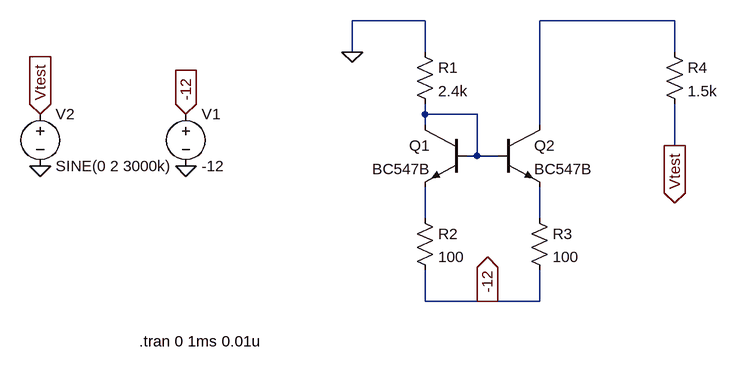
[diagram p0: schematic lab6.1.1c.asc]
lab6.1.1c.asc, the LTspice schematic file:
Version 4
SHEET 1 880 680
WIRE 80 -96 -32 -96
WIRE 464 -96 256 -96
WIRE -32 -48 -32 -96
WIRE 80 -48 80 -96
WIRE 464 -48 464 -96
WIRE 80 48 80 32
WIRE 160 48 80 48
WIRE 80 64 80 48
WIRE 256 64 256 -96
WIRE 464 96 464 32
WIRE 160 112 160 48
WIRE 160 112 144 112
WIRE 192 112 160 112
WIRE 80 208 80 160
WIRE 256 208 256 160
WIRE 80 336 80 288
WIRE 176 336 80 336
WIRE 256 336 256 288
WIRE 256 336 176 336
FLAG -32 -48 0
FLAG -288 128 0
FLAG -288 48 -12
IOPIN -288 48 In
FLAG 176 336 -12
IOPIN 176 336 Out
FLAG -512 128 0
FLAG -512 48 Vtest
IOPIN -512 48 In
FLAG 464 96 Vtest
IOPIN 464 96 Out
SYMBOL res 64 -64 R0
SYMATTR InstName R1
SYMATTR Value 2.4k
SYMBOL npn 144 64 M0
SYMATTR InstName Q1
SYMATTR Value BC547B
SYMBOL npn 192 64 R0
SYMATTR InstName Q2
SYMATTR Value BC547B
SYMBOL res 64 192 R0
SYMATTR InstName R2
SYMATTR Value 100
SYMBOL res 240 192 R0
SYMATTR InstName R3
SYMATTR Value 100
SYMBOL res 448 -64 R0
SYMATTR InstName R4
SYMATTR Value 1.5k
SYMBOL voltage -288 32 R0
SYMATTR InstName V1
SYMATTR Value -12
SYMBOL voltage -512 32 R0
WINDOW 123 0 0 Left 0
WINDOW 39 0 0 Left 0
SYMATTR InstName V2
SYMATTR Value SINE(0 2 3000k)
TEXT -360 398 Left 2 !.tran 0 1ms 0.01u

The netlist it stands for:
* lab6.1.1c.asc
R1 0 N002 2.4k
Q1 N002 N002 N003 0 BC547B
Q2 N001 N002 N004 0 BC547B
R2 N003 -12 100
R3 N004 -12 100
R4 N001 Vtest 1.5k
V1 -12 0 -12
V2 Vtest 0 SINE(0 2 3000k)
.model NPN NPN
.model PNP PNP
.lib standard.bjt
.tran 0 1ms 0.01u
.backanno
.end